# Altium project SEG_pressure gauge_don  V2.3.PrjPCB
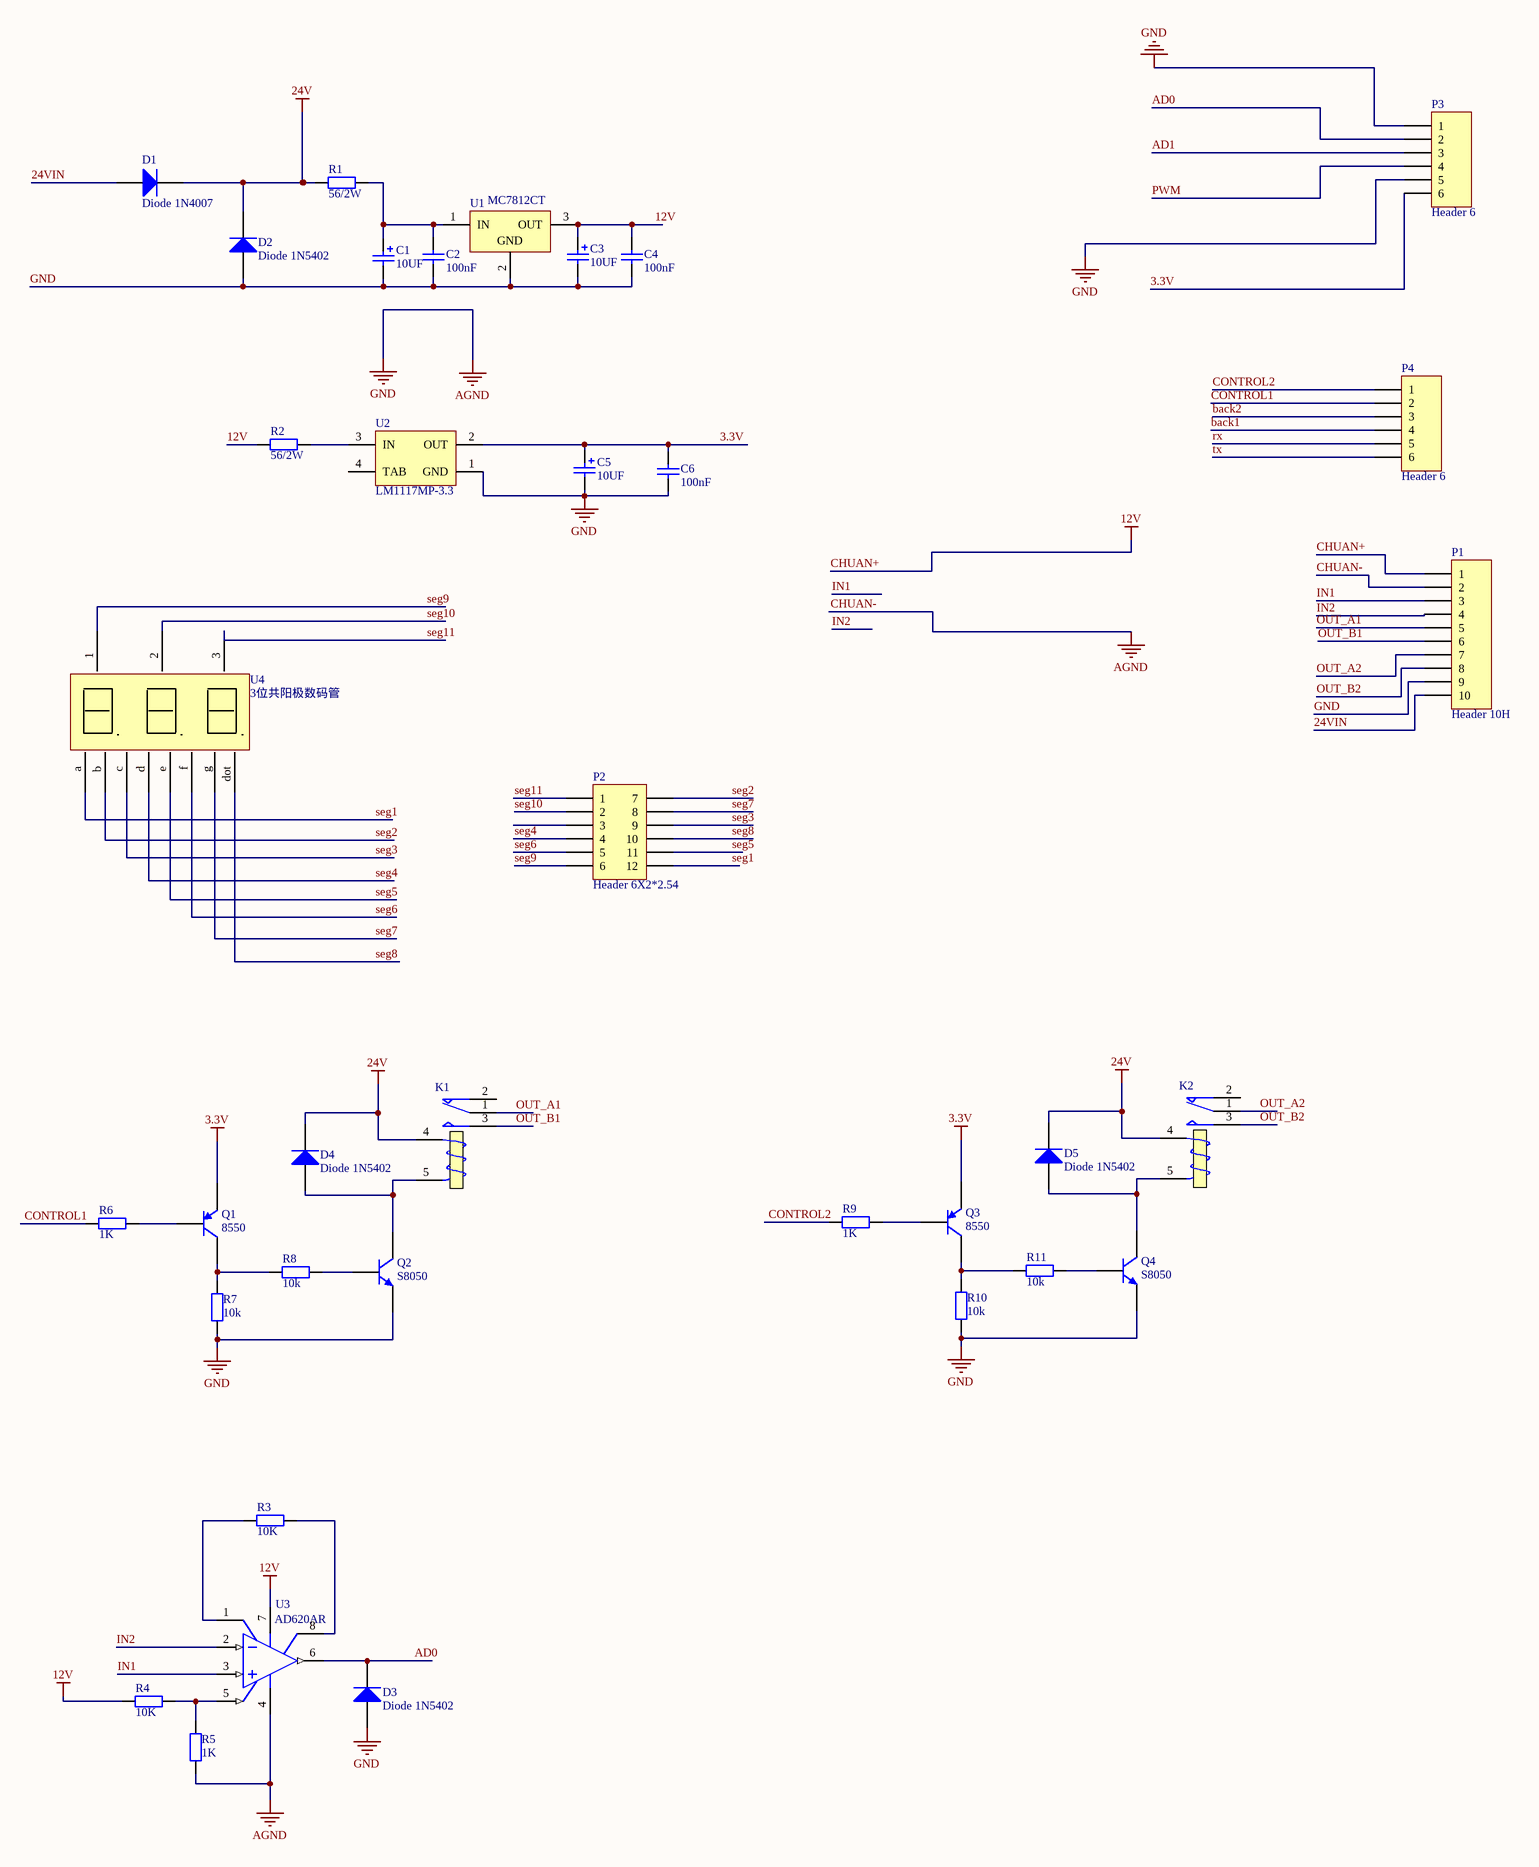
[diagram p0: SEG_pressure gauge_don  V2.3.SchDoc]
1 sheet, 36 parts. Net scope: global (net labels, ports and power ports of the same name join across sheets).
Board file: SEG_pressure gauge_don  V2.3.PcbDoc

## Sheet SEG_pressure gauge_don  V2.3.SchDoc
size A2

### Parts
C1  10uf  [3216]
C2  100nf  [0805_C_Y]
C3  10uf  [3216]
C4  100nf  [0805_C_Y]
C5  10uf  [3216]
C6  100nf  [0805_C_Y]
D1  Diode 1N4007  [DO-214]
D2  Diode 1N5402  [DO-214]
D3  Diode 1N5402  [DO-214]
D4  Diode 1N5402  [DO-214]
D5  Diode 1N5402  [DO-214]
K1  Relay  [HK4100F-DC24V-SHG??]  (value not drawn)
K2  Relay  [HK4100F-DC24V-SHG??]  (value not drawn)
P1  Header 10H  [HDR1X10H]
P2  Header 6X2*2.54  [HDR2X6_CEN]
P3  Header 6  [HDR1X6]
P4  Header 6  [HDR1X6]
Q1  8550  [SOT-23_Y]
Q2  S8050  [SOT-23_Y]
Q3  8550  [SOT-23_Y]
Q4  S8050  [SOT-23_Y]
R1  56/2W  [PCBComponent_1 - duplicate]
R2  56/2W  [PCBComponent_1 - duplicate]
R3  10k  [0805_R_Y]
R4  10k  [0805_R_Y]
R5  1k  [0805_R_Y]
R6  value 1K  [0805_R_Y]  (hidden comment: 470)
R7  10k  [0805_R_Y]
R8  10k  [0805_R_Y]
R9  value 1K  [0805_R_Y]  (hidden comment: 470)
R10  10k  [0805_R_Y]
R11  10k  [0805_R_Y]
U1  MC7812CT  [TO-220]
U2  LM1117MP-3.3  [MP04A_M]
U3  AD620AR  [SO-8_Y]
U4  3位共阳极数码管  [3位数码管0.56]

### Nets
3.3V: C5.1 C6.1 P3.6 Q1.2(E) Q3.2(E) U2.2(OUT)
12V: C3.1 C4.1 P1.1 R2.1 R4.2 U1.3(OUT) U3.7(V+)  [also labelled CHUAN+]
24V: D1.2(K) D2.2(K) D4.2(K) D5.2(K) K1.4(T1) K2.4(T1) R1.1
CHUAN-: C1.2 C2.2 C3.2 C4.2 C5.2 C6.2 D2.1(A) D3.1(A) P1.2 P1.9 P3.1 P3.5 Q2.2(E) Q4.2(E) R5.1 R7.1 R10.1 U1.2(GND) U2.1(GND) U3.4(V-)  [also labelled AGND, GND]
24VIN: D1.1(A) P1.10
AD0: D3.2(K) P3.2 U3.6(OUT)
AD1: P3.3
back1: P4.4
back2: P4.3
CONTROL1: P4.2 R6.2
CONTROL2: P4.1 R9.2
IN1: P1.3 U3.3(+IN)
IN2: P1.4 U3.2(-IN)
OUT_A1: K1.1(COM) P1.5
OUT_A2: K2.1(COM) P1.7
OUT_B1: K1.3(NO) P1.6
OUT_B2: K2.3(NO) P1.8
PWM: P3.4
rx: P4.5
seg1: P2.12 U4.a
seg2: P2.7 U4.b
seg3: P2.9 U4.c
seg4: P2.4 U4.d
seg5: P2.11 U4.e
seg6: P2.5 U4.f
seg7: P2.8 U4.g
seg8: P2.10 U4.dot
seg9: P2.6 U4.1
seg10: P2.2 U4.2
seg11: P2.1 U4.3
tx: P4.6
NetC1_1: C1.1 C2.1 R1.2 U1.1(IN)
NetD4_1: D4.1(A) K1.5(T2) Q2.3(C)
NetD5_1: D5.1(A) K2.5(T2) Q4.3(C)
NetQ1_1: Q1.1(B) R6.1
NetQ1_3: Q1.3(C) R7.2 R8.2
NetQ2_1: Q2.1(B) R8.1
NetQ3_1: Q3.1(B) R9.1
NetQ3_3: Q3.3(C) R10.2 R11.2
NetQ4_1: Q4.1(B) R11.1
NetR2_2: R2.2 U2.3(IN)
NetR3_1: R3.1 U3.1(RG)
NetR3_2: R3.2 U3.8(RG)
NetR4_1: R4.1 R5.2 U3.5(REF)

Not connected (* = marked no-connect by the designer): K1 2(NC); K2 2(NC); P2 3; U2 4(TAB)

### Library data of the parts
C1 C3 C5 = Cap Pol2: Polarized Capacitor (Axial); Published: 8-Jun-2000; LatestRevisionDate: 17-Jul-2002; LatestRevisionNote: Re-released for DXP Platform.; PackageReference: POLAR0.8; Publisher: Altium Limited; Value: 10UF
C2 C4 C6 = Cap: Capacitor; Published: 8-Jun-2000; LatestRevisionDate: 17-Jul-2002; LatestRevisionNote: Re-released for DXP Platform.; PackageReference: RAD-0.3; Publisher: Altium Limited; Value: 100nF
D1 = Diode 1N4007: 1 Amp General Purpose Rectifier; Published: 8-Jun-2000; LatestRevisionDate: 17-Jul-2002; LatestRevisionNote: Re-released for DXP Platform.; DatasheetVersion: 1998; PackageVersion: Aug-1999; PackageReference: DO-41; Publisher: Altium Limited; Code_JEDEC: DO-204-AL; ComponentLink1Description: Manufacturer Link; ComponentLink1URL: http://www.fairchildsemi.com/; ComponentLink2Description: Datasheet; ComponentLink2URL: http://www.fairchildsemi.com/ds/1N%2F1N4001.pdf
D2-D5 = Diode 1N5402: 3 Amp General Purpose Rectifier; Published: 8-Jun-2000; LatestRevisionDate: 17-Jul-2002; LatestRevisionNote: Re-released for DXP Platform.; DatasheetVersion: 1998; PackageVersion: Aug-1999; PackageReference: DO-201AD; Publisher: Altium Limited; ComponentLink1Description: Manufacturer Link; ComponentLink1URL: http://www.fairchildsemi.com/; ComponentLink2Description: Datasheet; ComponentLink2URL: http://www.fairchildsemi.com/ds/1N%2F1N5400.pdf
K1 K2 = Relay: SPDT Relay; Published: 8-Jun-2000; LatestRevisionDate: 17-Jul-2002; LatestRevisionNote: Re-released for DXP Platform.; PackageReference: MODULE5B; Publisher: Altium Limited
P1 = Header 10H: Header, 10-Pin, Right Angle; LatestRevisionDate: 17-Jul-2002; LatestRevisionNote: Re-released for DXP Platform.; Publisher: Altium Limited
P2 = Header 6X2A: Header, 6-Pin, Dual row; LatestRevisionDate: 17-Jul-2002; LatestRevisionNote: Re-released for DXP Platform.; Publisher: Altium Limited
P3 P4 = Header 6: Header, 6-Pin; LatestRevisionDate: 17-Jul-2002; LatestRevisionNote: Re-released for DXP Platform.; Publisher: Altium Limited
Q1 Q3 = 2N3906: PNP General Purpose Amplifier; Published: 8-Jun-2000; LatestRevisionDate: 15-Jan-2003; LatestRevisionNote: PCB Footprint 'BCY-W3/D4.7' replaced; DatasheetVersion: 1997; PackageVersion: Sep-1998; PackageReference: TO-92A; Publisher: Altium Limited; Code_JEDEC: TO-92A; ComponentLink1Description: Manufacturer Link; ComponentLink1URL: http://www.fairchildsemi.com/; ComponentLink2Description: Datasheet; ComponentLink2URL: http://www.fairchildsemi.com/ds/2N%2F2N3906.pdf
Q2 Q4 = 2N3904: NPN General Purpose Amplifier; Published: 8-Jun-2000; LatestRevisionDate: 15-Jan-2003; LatestRevisionNote: PCB Footprint 'BCY-W3/D4.7' replaced; DatasheetVersion: 1997; PackageVersion: Sep-1998; PackageReference: TO-92A; Publisher: Altium Limited; Code_JEDEC: TO-92A; ComponentLink1Description: Manufacturer Link; ComponentLink1URL: http://www.fairchildsemi.com/; ComponentLink2Description: Datasheet; ComponentLink2URL: http://www.fairchildsemi.com/ds/2N%2F2N3904.pdf
R1-R11 = Res2: Resistor; Published: 8-Jun-2000; LatestRevisionDate: 17-Jul-2002; LatestRevisionNote: Re-released for DXP Platform.; PackageReference: AXIAL-0.4; Publisher: Altium Limited
  R1 R2: Value: 56/2W
  R3 R4: Value: 10K
  R5: Value: 1K
  R7 R8 R10 R11: Value: 10k
U1 = MC7812CT: Three-Terminal Positive Voltage Regulator; Note: Heatsink surface is connected to Pin 2; Published: 15-Apr-2002; DatasheetVersion: 1997; PackageVersion: 1997; PackageReference: 221A-06; Publisher: Altium Limited; PackageDescription: TO, Thru-Hole, Vertical, Heatsink Mounted; 3 In-Line Leads; Pitch 2.54 mm; Code_JEDEC: TO-262-AA; ComponentLink1Description: Manufacturer Link; ComponentLink1URL: http://www.onsemi.com/site/products/taxonomy/0,4438,503,00.html; ComponentLink2Description: Datasheet; ComponentLink2URL: http://www.onsemi.com/pub/Collateral/MC7800-D.PDF
U2 = LM1117MP-3.3: 800mA Low-Dropout Linear Regulator; Manufacturer: National Semiconductor; CompType: LDO IC; PackageTopMarking: XYTT*N05A; PowerWise: N; Published: 4-Dec-2008; DatasheetVersion: Apr-2006; PackageVersion: revB, Apr-2003; PackageReference: MP04A; Publisher: Altium Limited; PackageDescription: Molded SOT-223, 6.50 x 3.56 x 1.6mm Body, 4 Lead, 2.3mm Pitch; PartNumber: LM1117MP-3.3; RoHS: O; PinCount: 4; DigiKeyPartNumber: LM1117MP-3.3CT-ND; Code_JEDEC: TO-261-AA; Code_IPC: SOT223-4; ComponentLink1Description: LM1117 Datasheet; ComponentLink1URL: http://www.national.com/ds/LM/LM1117.pdf; ComponentLink2Description: LM1117 Web Page; ComponentLink2URL: http://www.national.com/pf/LM/LM1117.html; ComponentLink3Description: MP04A Package Page; ComponentLink3URL: http://www.national.com/packaging/folders/mp04a.html
U3 = AD620AR: Low-Cost, Low-Power Instrumentation Amplifier; Published: 8-Jun-2000; LatestRevisionDate: 13-Apr-2006; LatestRevisionNote: IPC-7351 Footprint Added.; DatasheetVersion: REV.D 1998; PackageVersion: 1998; PackageReference: R-8D; Publisher: Altium Limited; PackageDescription: 8-Pin Narrow Body Small Outline Integrated Circuit 1.27 mm Pitch; ComponentLink1Description: Manufacturer Link; ComponentLink1URL: http://www.analog.com/en/prod/0%2C2877%2CAD620%2C00.html; ComponentLink2Description: Datasheet; ComponentLink2URL: http://www.analog.com/UploadedFiles/Data_Sheets/897653854AD620_g.pdf